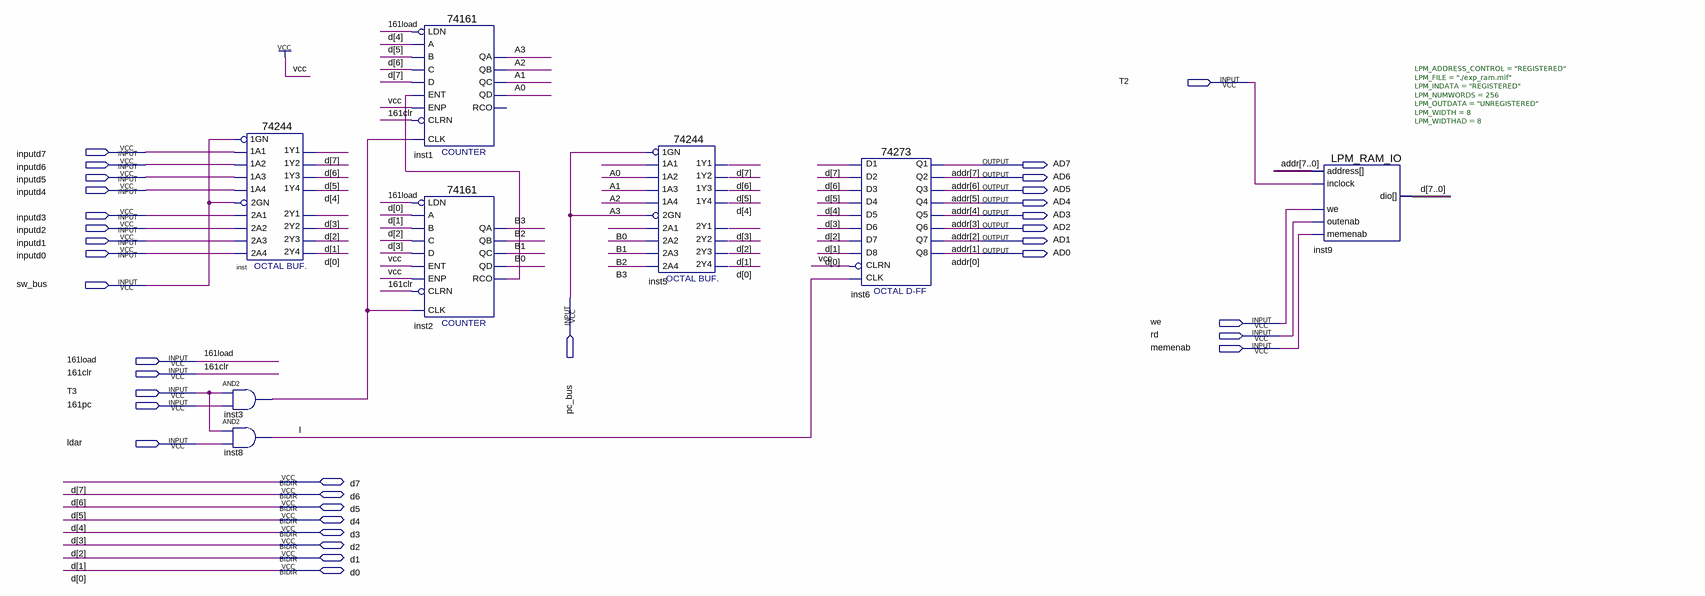
[diagram p0: schematic sheet]
// Quartus schematic exp_RAM.bdf as structural Verilog: 8 symbols, 35 pins
module exp_RAM (
  input  T2,
  input  inputd7,
  input  inputd6,
  input  inputd5,
  input  inputd4,
  input  inputd3,
  input  inputd2,
  input  inputd1,
  input  inputd0,
  input  sw_bus,
  input  pc_bus,
  input  we,
  input  rd,
  input  memenab,
  input  \161load ,
  input  \161clr ,
  input  T3,
  input  \161pc ,
  input  ldar,
  inout  d7,
  inout  d6,
  inout  d5,
  inout  d4,
  inout  d3,
  inout  d2,
  inout  d1,
  inout  d0,
  output AD7,
  output AD6,
  output AD5,
  output AD4,
  output AD3,
  output AD2,
  output AD1,
  output AD0
);

  wire A0, A1, A2, A3, B0, B1, B2, B3, inst2_rco, inst3_out, l;

  \74244  inst (
    .\1A2 (inputd6), .\1A4 (inputd4), .\1A1 (inputd7), .\1A3 (inputd5), .\1GN (sw_bus), .\2A3 (inputd1),
    .\2GN (sw_bus), .\2A1 (inputd3), .\2A4 (inputd0), .\2A2 (inputd2), .\1Y2 (d6), .\1Y4 (d4), .\2Y1 (d3),
    .\1Y1 (d7), .\2Y3 (d1), .\2Y4 (d0), .\1Y3 (d5), .\2Y2 (d2));
  and inst3 (inst3_out, T3, \161pc );
  and inst8 (l, T3, ldar);
  \74161  inst1 (
    .CLRN(\161clr ), .CLK(inst3_out), .ENP(1'b1), .LDN(\161load ), .A(d4), .D(d7), .ENT(inst2_rco), .B(d5),
    .C(d6), .QD(A0), .QC(A1), .QB(A2), .QA(A3));  // open: RCO
  \74161  inst2 (
    .CLRN(\161clr ), .CLK(inst3_out), .ENP(1'b1), .LDN(\161load ), .A(d0), .D(d3), .ENT(1'b1), .B(d1),
    .C(d2), .QD(B0), .QC(B1), .QB(B2), .QA(B3), .RCO(inst2_rco));
  \74244  inst5 (
    .\1A2 (A1), .\1A4 (A3), .\1A1 (A0), .\1A3 (A2), .\1GN (pc_bus), .\2A3 (B2), .\2GN (pc_bus), .\2A1 (B0),
    .\2A4 (B3), .\2A2 (B1), .\1Y2 (d6), .\1Y4 (d4), .\2Y1 (d3), .\1Y1 (d7), .\2Y3 (d1), .\2Y4 (d0),
    .\1Y3 (d5), .\2Y2 (d2));
  \74273  inst6 (
    .D2(d6), .D3(d5), .D1(d7), .D4(d4), .D7(d1), .D6(d2), .D5(d3), .D8(d0), .CLK(l), .CLRN(1'b1), .Q4(AD4),
    .Q1(AD7), .Q2(AD6), .Q3(AD5), .Q6(AD2), .Q5(AD3), .Q7(AD1), .Q8(AD0));
  LPM_RAM_IO #(.LPM_ADDRESS_CONTROL("REGISTERED"), .LPM_FILE("./exp_ram.mif"), .LPM_INDATA("REGISTERED"), .LPM_NUMWORDS(256), .LPM_OUTDATA("UNREGISTERED"), .LPM_WIDTH(8), .LPM_WIDTHAD(8)) inst9 (
    .address({AD7, AD6, AD5, AD4, AD3, AD2, AD1, AD0}), .memenab(memenab), .inclock(T2), .we(we),
    .outenab(rd), .dio({d7, d6, d5, d4, d3, d2, d1, d0}));

  // Other names for the same wires on the sheet: addr[7:0] = {AD7, AD6, AD5, AD4, AD3, AD2, AD1, AD0}
endmodule
